# EAGLE design ruwido-usb (EAGLE 6.4)
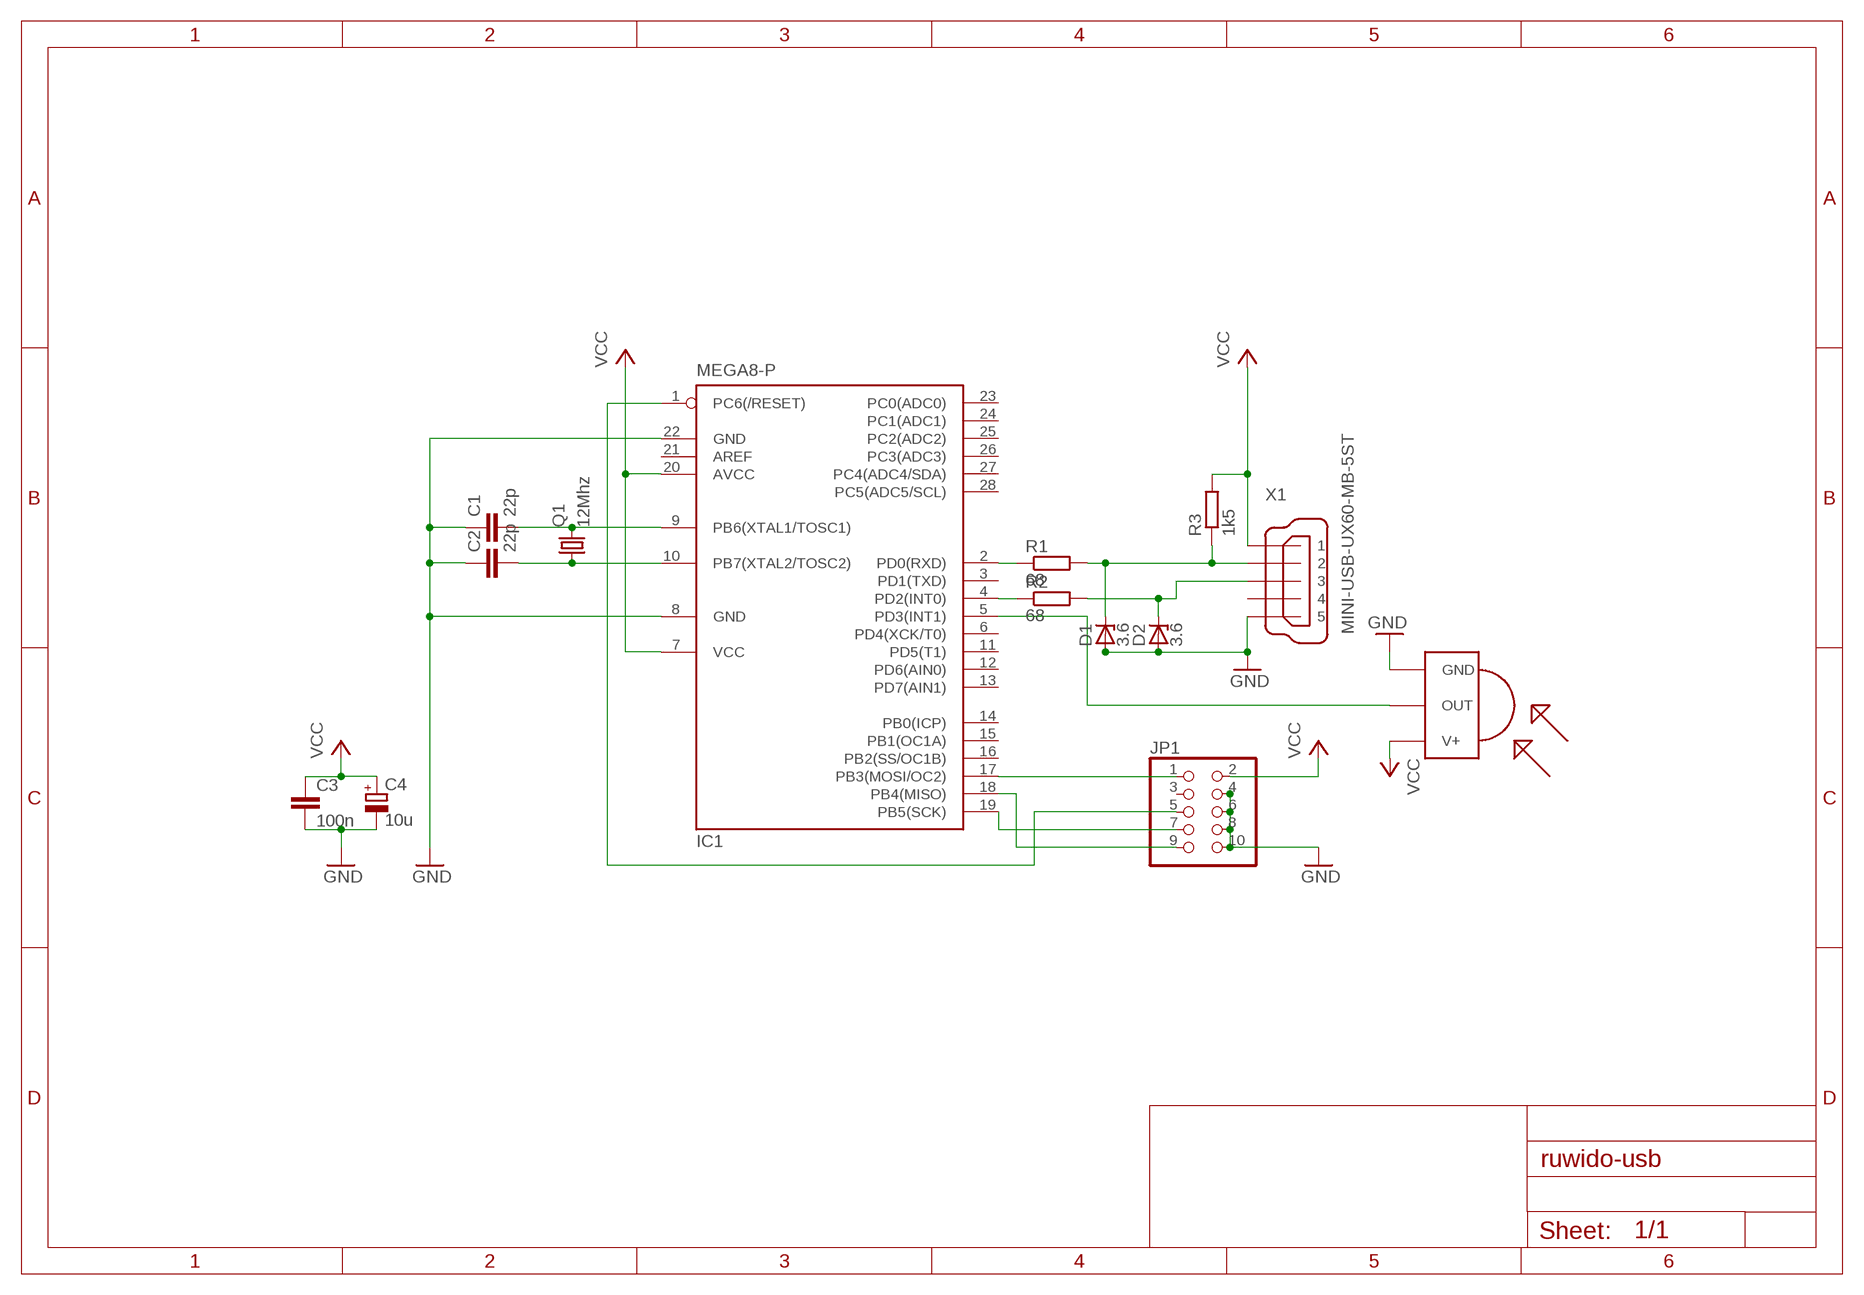
[diagram p0: schematic, sheet 1]

## Parts
C1  22p  C-EU025-024X044  [C025-024X044]
C2  22p  C-EU025-024X044  [C025-024X044]
C3  100n  C-EU025-024X044  [C025-024X044]
C4  10u  CPOL-EUE2.5-6  [E2,5-6]
D1  3.6  ZENER-DIODEDO34-7  [DO34Z7]
D2  3.6  ZENER-DIODEDO34-7  [DO34Z7]
IC1  MEGA8-P  [DIL28-3]
JP1  PINHD-2X5  [2X05]
Q1  12Mhz  CRYSTALHC49U70  [HC49U70]
R1  68  R-EU_0204/7  [0204/7]
R2  68  R-EU_0204/7  [0204/7]
R3  1k5  R-EU_0204/7  [0204/7]
U$1  TSOP1756  [TSOP17XX]
X1  MINI-USB-UX60-MB-5ST  [UX60-MB-5ST]

## Nets
GND: C1.1 C2.1 C3.2 C4.- D1.A D2.A IC1.8(GND) IC1.22(GND) JP1.4 JP1.6 JP1.8 JP1.10 U$1.GND X1.5
N$1: IC1.2(PD0(RXD)) R1.1
N$2: D1.C R1.2 R3.1 X1.2
N$3: IC1.4(PD2(INT0)) R2.1
N$4: D2.C R2.2 X1.3
N$5: C1.2 IC1.9(PB6(XTAL1/TOSC1)) Q1.2
N$6: C2.2 IC1.10(PB7(XTAL2/TOSC2)) Q1.1
N$7: IC1.5(PD3(INT1)) U$1.OUT
N$8: IC1.1(PC6(/RESET)) JP1.5
N$9: IC1.17(PB3(MOSI/OC2)) JP1.1
N$10: IC1.19(PB5(SCK)) JP1.7
N$11: IC1.18(PB4(MISO)) JP1.9
VCC: C3.1 C4.+ IC1.7(VCC) IC1.20(AVCC) JP1.2 R3.2 U$1.V+ X1.1
Unconnected: IC1.3(PD1(TXD)) IC1.6(PD4(XCK/T0)) IC1.11(PD5(T1)) IC1.12(PD6(AIN0)) IC1.13(PD7(AIN1)) IC1.14(PB0(ICP)) IC1.15(PB1(OC1A)) IC1.16(PB2(SS/OC1B)) IC1.21(AREF) IC1.23(PC0(ADC0)) IC1.24(PC1(ADC1)) IC1.25(PC2(ADC2)) IC1.26(PC3(ADC3)) IC1.27(PC4(ADC4/SDA)) IC1.28(PC5(ADC5/SCL)) JP1.3 X1.4

## Library data of the parts
C1-C3 = rcl:C-EU: CAPACITOR, European symbol
C4 = rcl:CPOL-EU: POLARIZED CAPACITOR, European symbol
D1 D2 = diode:ZENER-DIODE: Z-Diode
IC1 = atmel:MEGA8-P: MICROCONTROLLER 8 Kbytes FLASH, 1 kbytes SRAM, 512 bytes EEPROM, USART, 4-channel 10 bit ADC, 2-channel 8 bit ADC Pin compatible with Atmega48, ATMega88, ATMega168 Source: avr.lbr; OC_FARNELL: unknown; OC_NEWARK: unknown
JP1 = pinhead:PINHD-2X5: PIN HEADER
Q1 = crystal:CRYSTAL: CRYSTAL; OC_FARNELL: unknown; OC_NEWARK: unknown
R1-R3 = rcl:R-EU_: RESISTOR, European symbol
U$1 = tsop:TSOP1756: IR Receiver and Demodulator
X1 = con-hirose:MINI-USB-: MINI USB Connector Source: http://www.hirose.co.jp/cataloge_hp/e24000019.pdf; OC_FARNELL: unknown; OC_NEWARK: unknown

## Board
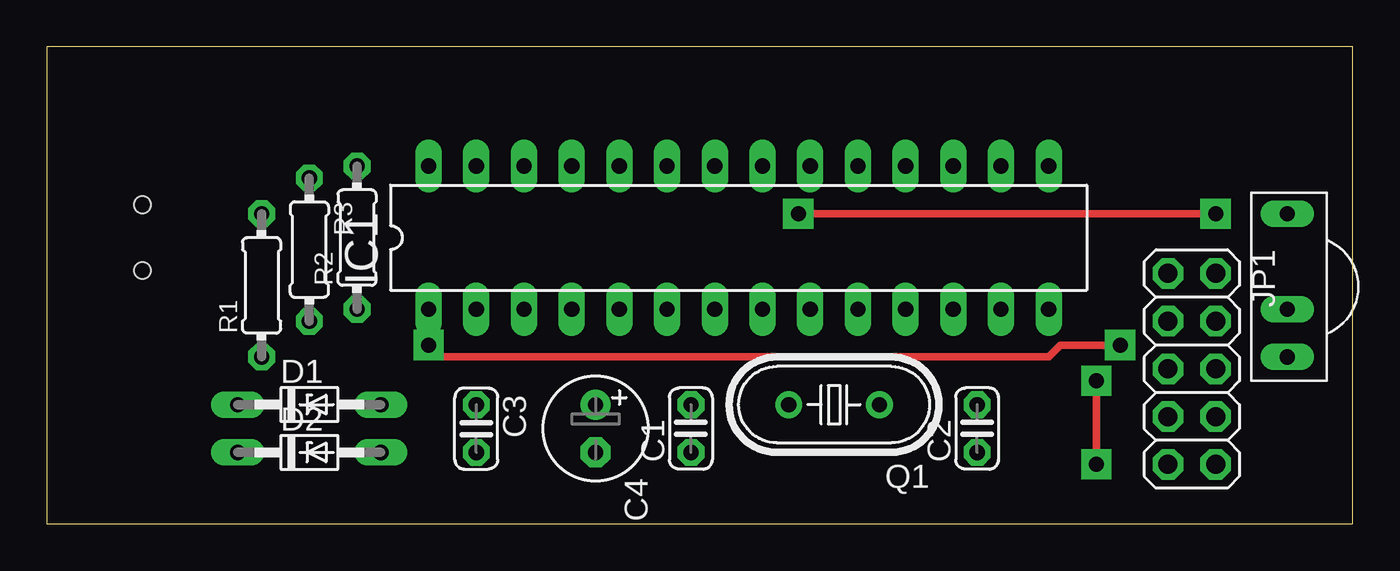
[diagram p1: board, top side]
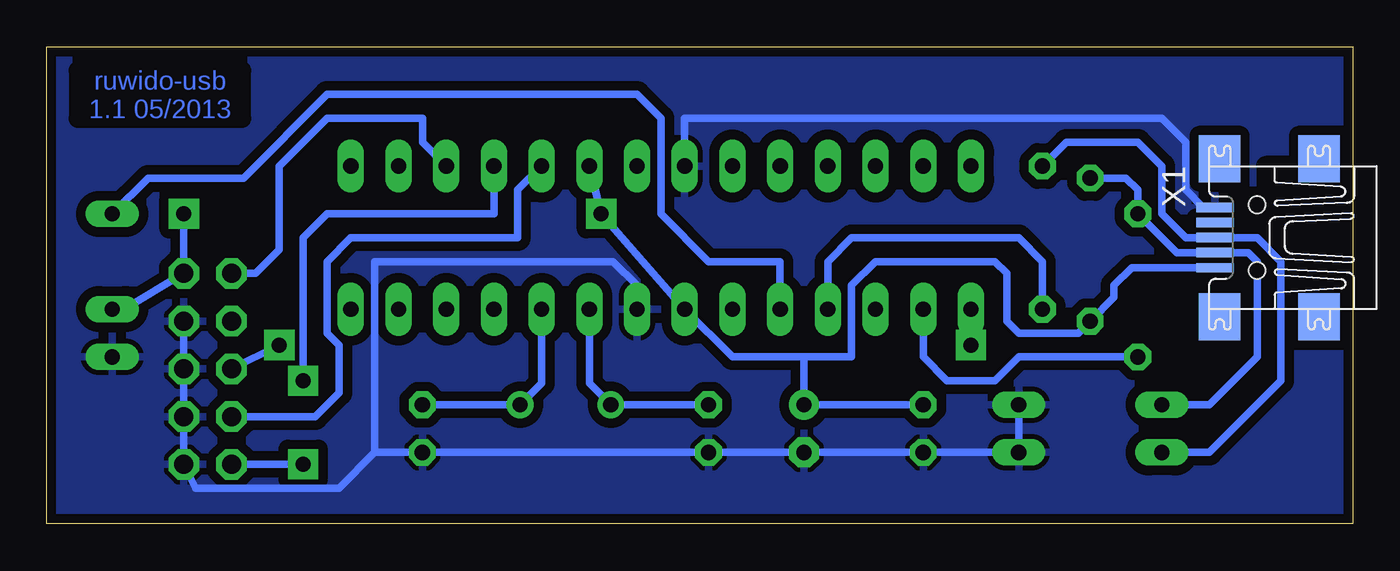
[diagram p2: board, bottom side, seen from below]

Size 69.52 x 25.39 mm. Coordinates in mm from the lower left corner, seen from the top.
Outline: 0,0 69.52,0 69.52,25.39 0,25.39 0,0
Copper layers (1*16): Top 0.035mm / dielectric 1.5mm / Bottom 0.035mm
Design rules "default *": minimum track width 5mil, minimum drill 0.8mm, track to track 12mil, track to pad 12mil, pad to pad 8mil, via to via 8mil, smd to smd 8mil, copper to edge 10mil, drill to drill 0.8mm, minimum pad ring 12mil, minimum via ring 16mil, stop-mask expansion 4mil, vias tented up to drill 0mil, thermal gap 10mil

### Footprints (pad centres in the part's own frame; a part is rotated, then mirrored left to right if it is on the bottom)
C025-024X044 = drill 0.813 octagon: 1 -1.27,0; 2 1.27,0
E2,5-6 = drill 0.813 pad 1.6: + -1.27,0 | drill 0.813 pad 1.6 octagon: - 1.27,0
DO34Z7 = drill 0.813 long: A 3.81,0; C -3.81,0
DIL28-3 = drill 0.813 long: 1 -16.51,-3.81; 2 -13.97,-3.81; 3 -11.43,-3.81; 4 -8.89,-3.81; 5 -6.35,-3.81; 6 -3.81,-3.81; 7 -1.27,-3.81; 8 1.27,-3.81; 9 3.81,-3.81; 10 6.35,-3.81; 11 8.89,-3.81; 12 11.43,-3.81; 13 13.97,-3.81; 14 16.51,-3.81; 15 16.51,3.81; 16 13.97,3.81; 17 11.43,3.81; 18 8.89,3.81; 19 6.35,3.81; 20 3.81,3.81; 21 1.27,3.81; 22 -1.27,3.81; 23 -3.81,3.81; 24 -6.35,3.81; 25 -8.89,3.81; 26 -11.43,3.81; 27 -13.97,3.81; 28 -16.51,3.81
2X05 = drill 1.016 octagon: 1 -5.08,-1.27; 2 -5.08,1.27; 3 -2.54,-1.27; 4 -2.54,1.27; 5 0,-1.27; 6 0,1.27; 7 2.54,-1.27; 8 2.54,1.27; 9 5.08,-1.27; 10 5.08,1.27
HC49U70 = drill 0.813: 1 -2.413,0; 2 2.413,0
0204/7 = drill 0.813 octagon: 1 -3.81,0; 2 3.81,0
TSOP17XX = drill 0.813 long: GND -3.81,0; OUT 3.81,0; V+ -1.27,0
UX60-MB-5ST = smd 2 x 0.5: 1 2.25,1.6; 2 2.25,0.8; 3 2.25,0; 4 2.25,-0.8; 5 2.25,-1.6 | smd 2.2 x 2.5: M1 -3.3,-4.2; M2 -3.3,4.2; M3 2,4.2; M4 2,-4.2 | hole 0.9: 0,-1.75; 0,1.75

### Placement (x,y rotation side)
C1  34.29,5.08 90 top
C2  49.53,5.08 90 top
C3  22.86,5.08 270 top
C4  29.21,5.08 270 top
D1  13.97,6.35 0 top
D2  13.97,3.81 0 top
IC1  36.83,15.24 0 top
JP1  60.96,8.26 270 top
Q1  41.91,6.35 180 top
R1  11.43,12.7 90 top
R2  16.51,15.24 90 top
R3  13.97,14.6 270 top
U$1  66.04,12.7 90 top
X1  5.08,15.24 180 bottom

### Tracks (layer width: path | path; a pad name or v marks a point on that pad's centre or on a via)
GND
  Bottom 0.406: IC1.22 35.56,21.59 10.16,21.59 8.89,20.32 8.89,17.78 7.95,16.84 X1.5 | D1.A D2.A C3.2 C4.- C1.1 C2.1 52.07,3.81 | JP1.4 JP1.6 JP1.8 JP1.10 61.59,1.91 53.98,1.91 52.07,3.81 | 52.07,3.81 52.07,13.97 39.37,13.97 38.1,12.7 IC1.8
  pour Bottom (isolate 0.508): 0,25.4 0,0 69.85,0 69.85,25.4
N$1
  Bottom 0.406: IC1.2 22.86,8.89 21.59,7.62 19.05,7.62 17.78,8.89 R1.1
N$2
  Bottom 0.406: R3.1 12.06,18.41 11.43,17.78 R1.2 9.36,14.44 X1.2 5.55,14.44 5.08,13.97 5.08,8.89 7.62,6.35 D1.C
N$3
  Bottom 0.406: IC1.4 27.94,13.97 26.67,15.24 17.78,15.24 16.51,13.97 R2.1
N$4
  Bottom 0.406: 8.89,3.81 D2.C 7.62,3.81 3.81,7.62 3.81,13.97 5.08,15.24 X1.3 8.89,15.24 10.16,16.51 10.16,19.05 11.43,20.32 15.24,20.32 R2.2
N$5
  Bottom 0.406: IC1.9 40.64,7.49 Q1.2 C1.2
N$6
  Bottom 0.406: IC1.10 43.18,7.49 Q1.1 C2.2
N$7
  Bottom 0.406: IC1.5 30.48,13.97 34.29,13.97 36.83,16.51 36.83,21.59 38.1,22.86 54.61,22.86 59.05,18.41 64.14,18.41 U$1.OUT
N$8  (via drill 0.8)
  Top 0.406: v20.32,9.52 20.95,8.89 53.34,8.89 53.98,9.52 v57.15,9.52
  Bottom 0.406: IC1.1 v20.32,9.52 | JP1.5 v57.15,9.52
N$9
  Bottom 0.406: IC1.17 49.53,20.32 49.53,21.59 54.61,21.59 57.15,19.05 57.15,14.6 58.42,13.34 JP1.1
N$10
  Bottom 0.406: IC1.19 44.45,17.78 44.45,15.24 53.34,15.24 54.61,13.97 54.61,10.16 53.98,9.52 53.98,6.98 55.24,5.71 JP1.7
N$11  (via drill 0.8)
  Top 0.406: v55.88,7.62 v55.88,3.17
  Bottom 0.406: IC1.18 45.72,16.51 54.61,16.51 55.88,15.24 v55.88,7.62 | v55.88,3.17 JP1.9
VCC  (via drill 0.8)
  Top 0.406: v40,16.51 v62.23,16.51
  Bottom 0.406: X1.1 11.76,13.64 12.7,12.7 12.7,12.06 R3.2 14.6,10.16 17.78,10.16 18.41,10.8 18.41,13.34 19.05,13.97 25.4,13.97 26.67,12.7 26.67,8.89 29.21,8.89 | 29.21,8.89 33.02,8.89 IC1.7 v40,16.51 IC1.20 | C3.1 C4.+ 29.21,8.89 | v62.23,16.51 JP1.2 65.41,11.43 U$1.V+

### Text on the board
Bottom: ruwido-usb / 1.1 05/2013